# Altium project RT1166_DevSoM.PrjPcb
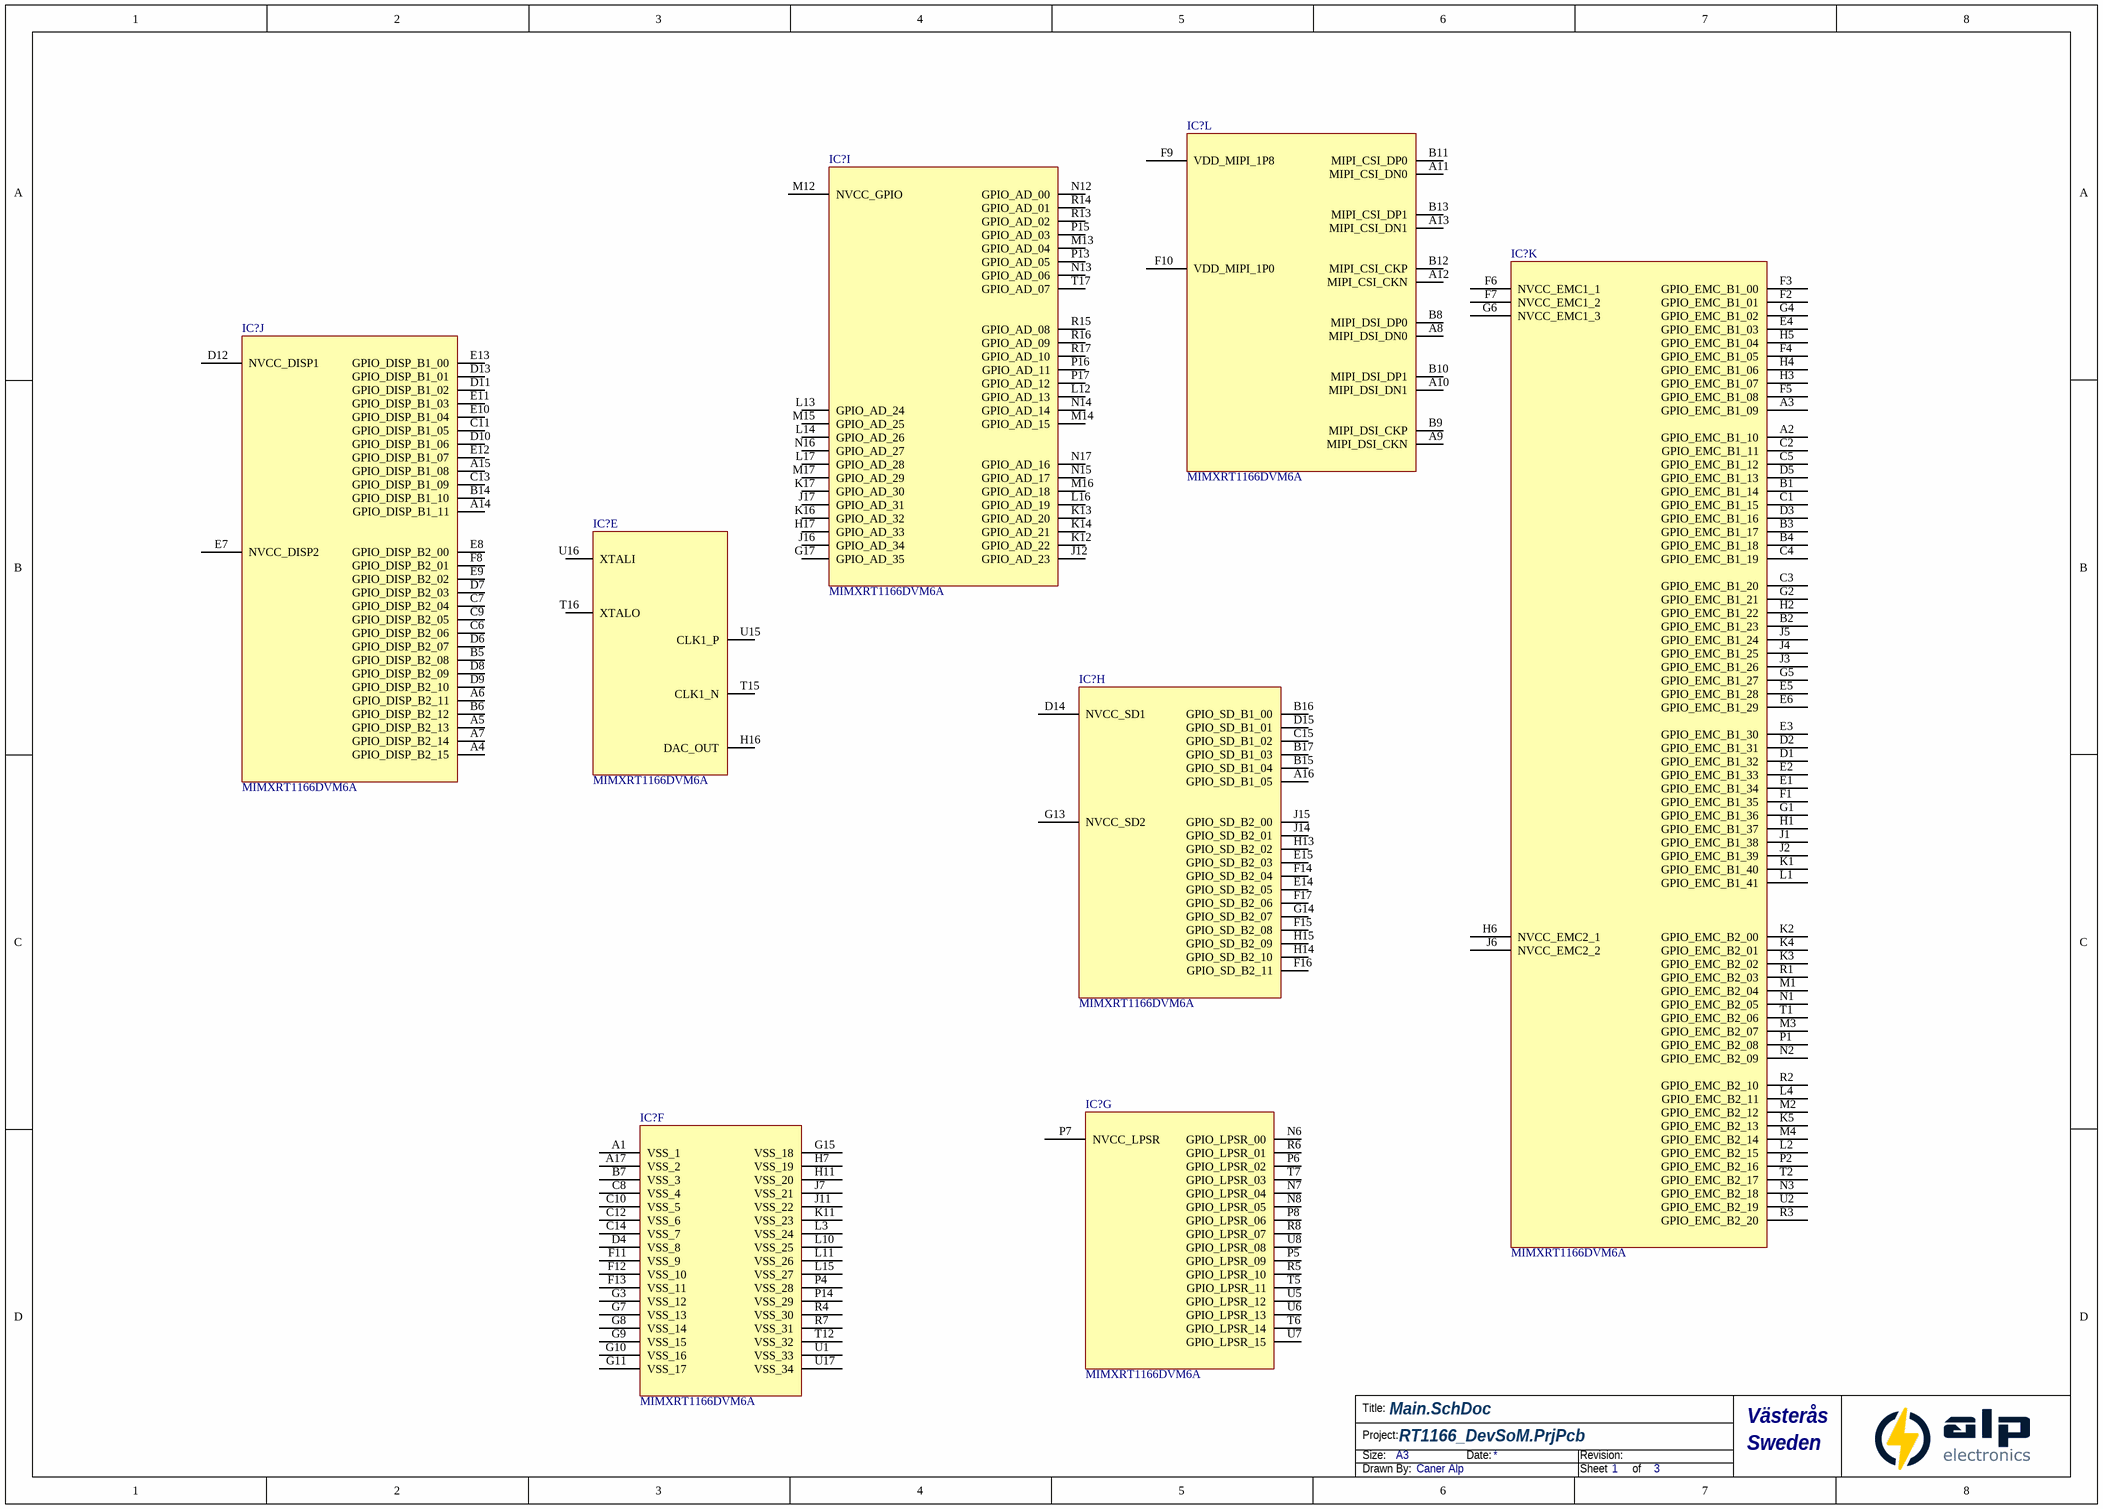
[diagram p0: Main.SchDoc]
3 sheets, 26 parts. Net scope: global (net labels, ports and power ports of the same name join across sheets).
Sheets:
  Main.SchDoc
  Power.SchDoc
  MCU Power.SchDoc

## Sheet Main.SchDoc
size A3; Author: ALP Electronics; CompanyName: ALP Electronics; DrawnBy: Caner Alp; Engineer: Caner Alp; Organization: ALP Electronics; Address2: Västerås; Address4: Sweden; SheetNumber: 1; SheetTotal: 3

### Parts
(Parts that share a designator on the sheet are numbered #1, #2 ... from top to bottom, then left to right.)
IC?#1  MIMXRT1166DVM6A  [BGA289C80P17X17_1400X1400X152]  (part L of 12)
IC?#2  MIMXRT1166DVM6A  [BGA289C80P17X17_1400X1400X152]  (part I of 12)
IC?#3  MIMXRT1166DVM6A  [BGA289C80P17X17_1400X1400X152]  (part K of 12)
IC?#4  MIMXRT1166DVM6A  [BGA289C80P17X17_1400X1400X152]  (part J of 12)
IC?#5  MIMXRT1166DVM6A  [BGA289C80P17X17_1400X1400X152]  (part E of 12)
IC?#6  MIMXRT1166DVM6A  [BGA289C80P17X17_1400X1400X152]  (part H of 12)
IC?#7  MIMXRT1166DVM6A  [BGA289C80P17X17_1400X1400X152]  (part G of 12)
IC?#8  MIMXRT1166DVM6A  [BGA289C80P17X17_1400X1400X152]  (part F of 12)

### Nets

Not connected (* = marked no-connect by the designer): IC?#1 A8(MIPI_DSI_DN0) A9(MIPI_DSI_CKN) A10(MIPI_DSI_DN1) A11(MIPI_CSI_DN0) A12(MIPI_CSI_CKN) A13(MIPI_CSI_DN1) B8(MIPI_DSI_DP0) B9(MIPI_DSI_CKP) B10(MIPI_DSI_DP1) B11(MIPI_CSI_DP0) B12(MIPI_CSI_CKP) B13(MIPI_CSI_DP1) F9(VDD_MIPI_1P8) F10(VDD_MIPI_1P0); IC?#2 G17(GPIO_AD_35) H17(GPIO_AD_33) J12(GPIO_AD_23) J16(GPIO_AD_34) J17(GPIO_AD_31) K12(GPIO_AD_22) K13(GPIO_AD_20) K14(GPIO_AD_21) K16(GPIO_AD_32) K17(GPIO_AD_30) L12(GPIO_AD_13) L13(GPIO_AD_24) L14(GPIO_AD_26) L16(GPIO_AD_19) L17(GPIO_AD_28) M12(NVCC_GPIO) M13(GPIO_AD_04) M14(GPIO_AD_15) M15(GPIO_AD_25) M16(GPIO_AD_18) M17(GPIO_AD_29) N12(GPIO_AD_00) N13(GPIO_AD_06) N14(GPIO_AD_14) N15(GPIO_AD_17) N16(GPIO_AD_27) N17(GPIO_AD_16) P13(GPIO_AD_05) P15(GPIO_AD_03) P16(GPIO_AD_11) P17(GPIO_AD_12) R13(GPIO_AD_02) R14(GPIO_AD_01) R15(GPIO_AD_08) R16(GPIO_AD_09) R17(GPIO_AD_10) T17(GPIO_AD_07); IC?#3 A2(GPIO_EMC_B1_10) A3(GPIO_EMC_B1_09) B1(GPIO_EMC_B1_14) B2(GPIO_EMC_B1_23) B3(GPIO_EMC_B1_17) B4(GPIO_EMC_B1_18) C1(GPIO_EMC_B1_15) C2(GPIO_EMC_B1_11) C3(GPIO_EMC_B1_20) C4(GPIO_EMC_B1_19) C5(GPIO_EMC_B1_12) D1(GPIO_EMC_B1_32) D2(GPIO_EMC_B1_31) D3(GPIO_EMC_B1_16) D5(GPIO_EMC_B1_13) E1(GPIO_EMC_B1_34) E2(GPIO_EMC_B1_33) E3(GPIO_EMC_B1_30) E4(GPIO_EMC_B1_03) E5(GPIO_EMC_B1_28) E6(GPIO_EMC_B1_29) F1(GPIO_EMC_B1_35) F2(GPIO_EMC_B1_01) F3(GPIO_EMC_B1_00) F4(GPIO_EMC_B1_05) F5(GPIO_EMC_B1_08) F6(NVCC_EMC1_1) F7(NVCC_EMC1_2) G1(GPIO_EMC_B1_36) G2(GPIO_EMC_B1_21) G4(GPIO_EMC_B1_02) G5(GPIO_EMC_B1_27) G6(NVCC_EMC1_3) H1(GPIO_EMC_B1_37) H2(GPIO_EMC_B1_22) H3(GPIO_EMC_B1_07) H4(GPIO_EMC_B1_06) H5(GPIO_EMC_B1_04) H6(NVCC_EMC2_1) J1(GPIO_EMC_B1_38) J2(GPIO_EMC_B1_39) J3(GPIO_EMC_B1_26) J4(GPIO_EMC_B1_25) J5(GPIO_EMC_B1_24) J6(NVCC_EMC2_2) K1(GPIO_EMC_B1_40) K2(GPIO_EMC_B2_00) K3(GPIO_EMC_B2_02) K4(GPIO_EMC_B2_01) K5(GPIO_EMC_B2_13) L1(GPIO_EMC_B1_41) L2(GPIO_EMC_B2_15) L4(GPIO_EMC_B2_11) M1(GPIO_EMC_B2_04) M2(GPIO_EMC_B2_12) M3(GPIO_EMC_B2_07) M4(GPIO_EMC_B2_14) N1(GPIO_EMC_B2_05) N2(GPIO_EMC_B2_09) N3(GPIO_EMC_B2_18) P1(GPIO_EMC_B2_08) P2(GPIO_EMC_B2_16) R1(GPIO_EMC_B2_03) R2(GPIO_EMC_B2_10) R3(GPIO_EMC_B2_20) T1(GPIO_EMC_B2_06) T2(GPIO_EMC_B2_17) U2(GPIO_EMC_B2_19); IC?#4 A4(GPIO_DISP_B2_15) A5(GPIO_DISP_B2_13) A6(GPIO_DISP_B2_11) A7(GPIO_DISP_B2_14) A14(GPIO_DISP_B1_11) A15(GPIO_DISP_B1_08) B5(GPIO_DISP_B2_08) B6(GPIO_DISP_B2_12) B14(GPIO_DISP_B1_10) C6(GPIO_DISP_B2_06) C7(GPIO_DISP_B2_04) C9(GPIO_DISP_B2_05) C11(GPIO_DISP_B1_05) C13(GPIO_DISP_B1_09) D6(GPIO_DISP_B2_07) D7(GPIO_DISP_B2_03) D8(GPIO_DISP_B2_09) D9(GPIO_DISP_B2_10) D10(GPIO_DISP_B1_06) D11(GPIO_DISP_B1_02) D12(NVCC_DISP1) D13(GPIO_DISP_B1_01) E7(NVCC_DISP2) E8(GPIO_DISP_B2_00) E9(GPIO_DISP_B2_02) E10(GPIO_DISP_B1_04) E11(GPIO_DISP_B1_03) E12(GPIO_DISP_B1_07) E13(GPIO_DISP_B1_00) F8(GPIO_DISP_B2_01); IC?#5 H16(DAC_OUT) T15(CLK1_N) T16(XTALO) U15(CLK1_P) U16(XTALI); IC?#6 A16(GPIO_SD_B1_05) B15(GPIO_SD_B1_04) B16(GPIO_SD_B1_00) B17(GPIO_SD_B1_03) C15(GPIO_SD_B1_02) D14(NVCC_SD1) D15(GPIO_SD_B1_01) E14(GPIO_SD_B2_05) E15(GPIO_SD_B2_03) F14(GPIO_SD_B2_04) F15(GPIO_SD_B2_08) F16(GPIO_SD_B2_11) F17(GPIO_SD_B2_06) G13(NVCC_SD2) G14(GPIO_SD_B2_07) H13(GPIO_SD_B2_02) H14(GPIO_SD_B2_10) H15(GPIO_SD_B2_09) J14(GPIO_SD_B2_01) J15(GPIO_SD_B2_00); IC?#7 N6(GPIO_LPSR_00) N7(GPIO_LPSR_04) N8(GPIO_LPSR_05) P5(GPIO_LPSR_09) P6(GPIO_LPSR_02) P7(NVCC_LPSR) P8(GPIO_LPSR_06) R5(GPIO_LPSR_10) R6(GPIO_LPSR_01) R8(GPIO_LPSR_07) T5(GPIO_LPSR_11) T6(GPIO_LPSR_14) T7(GPIO_LPSR_03) U5(GPIO_LPSR_12) U6(GPIO_LPSR_13) U7(GPIO_LPSR_15) U8(GPIO_LPSR_08); IC?#8 A1(VSS_1) A17(VSS_2) B7(VSS_3) C8(VSS_4) C10(VSS_5) C12(VSS_6) C14(VSS_7) D4(VSS_8) F11(VSS_9) F12(VSS_10) F13(VSS_11) G3(VSS_12) G7(VSS_13) G8(VSS_14) G9(VSS_15) G10(VSS_16) G11(VSS_17) G15(VSS_18) H7(VSS_19) H11(VSS_20) J7(VSS_21) J11(VSS_22) K11(VSS_23) L3(VSS_24) L10(VSS_25) L11(VSS_26) L15(VSS_27) P4(VSS_28) P14(VSS_29) R4(VSS_30) R7(VSS_31) T12(VSS_32) U1(VSS_33) U17(VSS_34)

### Notes on the sheet
- Title:
- Size:
- Project:
- A3
- Date:
- Revision:
- Drawn By:
- Sheet
- of

### Library data of the parts
IC?#1-IC?#8 = MIMXRT1166DVM6A: Integrated Circuit; Manufacturer_Name: NXP; Datasheet Link: https://www.mouser.in/datasheet/2/302/IMXRT1160CEC-2335852.pdf; Height: 1.52mm; Manufacturer_Part_Number: MIMXRT1166DVM6A; Mouser Part Number: 771-MIMXRT1166DVM6A; Mouser Price/Stock: https://www.mouser.co.uk/ProductDetail/NXP-Semiconductors/MIMXRT1166DVM6A?qs=DRkmTr78QARbPfoaiaD1vg%3D%3D

## Sheet Power.SchDoc
size A3; Author: ALP Electronics; CompanyName: ALP Electronics; DrawnBy: Caner Alp; Engineer: Caner Alp; Organization: ALP Electronics; Address2: Västerås; Address4: Sweden; SheetNumber: 2; SheetTotal: 3
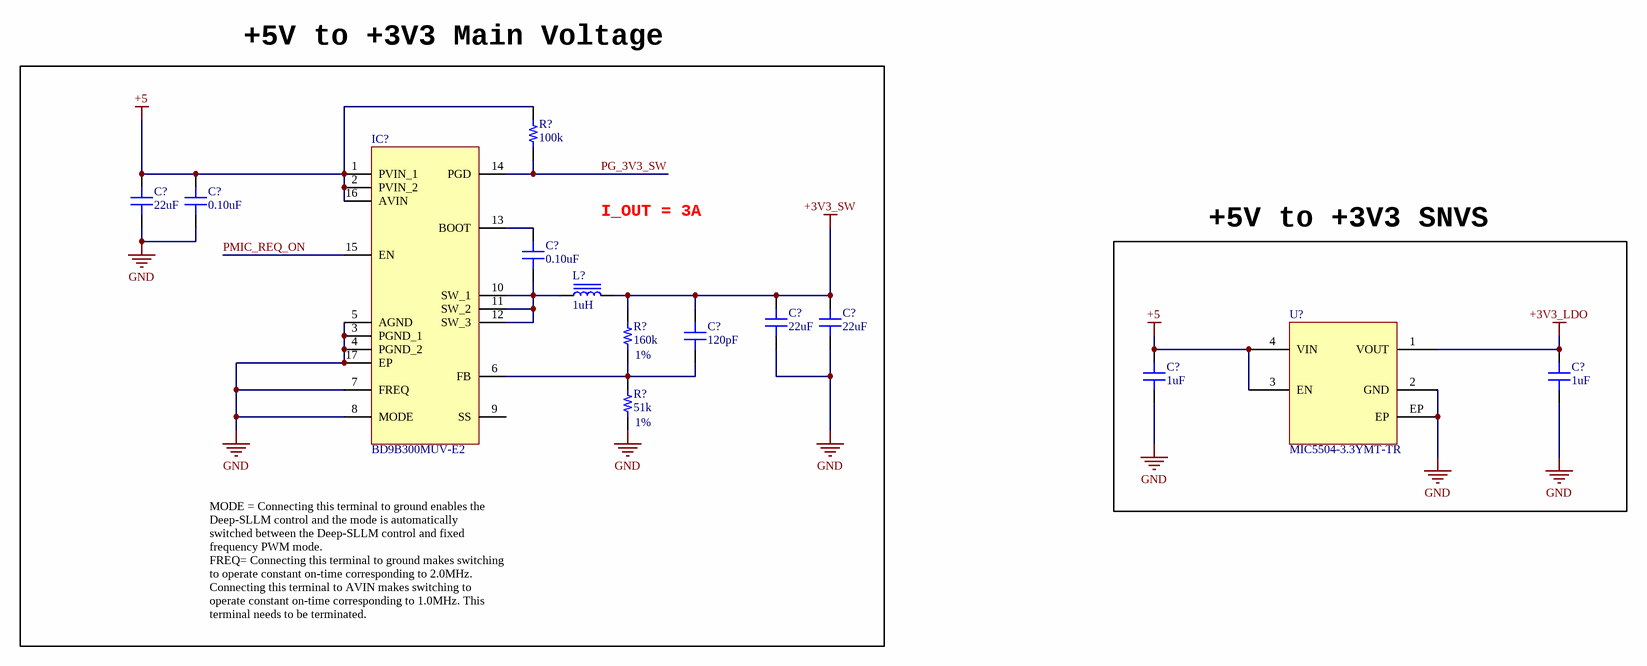
[diagram p1: Power.SchDoc]

### Parts
(Parts that share a designator on the sheet are numbered #1, #2 ... from top to bottom, then left to right.)
C?#1  22uF  [CAP 0805/2012]
C?#2  0.10uF  [CAP 0402/1005]
C?#3  0.10uF  [CAP 0402/1005]
C?#4  22uF  [CAP 0805/2012]
C?#5  22uF  [CAP 0805/2012]
C?#6  120pF  [CAP 0402/1005]
C?#7  1uF  [CAP 0402/1005]
C?#8  1uF  [CAP 0402/1005]
IC?#9  BD9B300MUV-E2  [QFN50P300X300X100-17N-D]
L?  1uH  [TDK VLS252012HBX-1]
R?#1  100k  [RES 0402/1005]
R?#2  160k  Tolerance: 1%  [RES 0402/1005]
R?#3  51k  Tolerance: 1%  [RES 0402/1005]
U?  MIC5504-3.3YMT-TR  [VREG_MIC5504-3.3YMT-TZ]

### Blocks framed on the sheet
+5V to +3V3 Main Voltage: C?#1-C?#6 IC?#9 L? R?#1-R?#3
+5V to +3V3 SNVS: C?#7 C?#8 U?

### Nets
+3V3_LDO: C?#8.2 U?.1(VOUT)
+3V3_SW: C?#4.2 C?#5.2 C?#6.2 L?.2 R?#2.2
+5: C?#1.2 C?#2.2 C?#7.2 IC?#9.1(PVIN_1) IC?#9.2(PVIN_2) IC?#9.16(AVIN) R?#1.1 U?.3(EN) U?.4(VIN)
GND: C?#1.1 C?#2.1 C?#4.1 C?#5.1 C?#7.1 C?#8.1 IC?#9.3(PGND_1) IC?#9.4(PGND_2) IC?#9.5(AGND) IC?#9.7(FREQ) IC?#9.8(MODE) IC?#9.17(EP) R?#3.1 U?.2(GND) U?.EP
PG_3V3_SW: IC?#9.14(PGD) R?#1.2
PMIC_REQ_ON: IC?#9.15(EN)
NetC?#3_1: C?#3.1 IC?#9.10(SW_1) IC?#9.11(SW_2) IC?#9.12(SW_3) L?.1
NetC?#3_2: C?#3.2 IC?#9.13(BOOT)
NetC?#6_1: C?#6.1 IC?#9.6(FB) R?#2.1 R?#3.2

Not connected (* = marked no-connect by the designer): IC?#9 9(SS)

### Notes on the sheet
- I_OUT = 3A
- MODE = Connecting this terminal to ground enables the Deep-SLLM control and the mode is automatically  switched between the Deep-SLLM control and fixed frequency PWM mode.
  FREQ= Connecting this terminal to ground makes switching to operate constant on-time corresponding to 2.0MHz. Connecting this terminal to AVIN makes switching to operate constant on-time corresponding to 1.0MHz. This terminal needs to be terminated.
- Title:
- Size:
- Project:
- A3
- Date:
- Revision:
- Drawn By:
- Sheet
- of

### Library data of the parts
C?#1 C?#4 C?#5 = C2012X5R0J226M125AC: CAP CER 22UF 6.3V X5R 0805; Manufacturer: TDK Corporation; TemperatureRange: -55C ~ 85C; Tolerance: 20%; Value: 22uF; Part Number: C2012X5R0J226M125AC; PartId: 4616; Supplier 1: Digi-Key; Supplier Part Number 1: 445-1422-2-ND; ComponentLink1Description: Datasheet; ComponentLink1URL: https://product.tdk.com/info/en/catalog/datasheets/mlcc_commercial_general_en.pdf; ComponentLink2Description: Digi-Key listing; ComponentLink2URL: http://digikey.com/product-detail/en/C2012X5R0J226M125AC/445-1422-2-ND/569048; TemperatureCoefficient: X5R; Voltage: 6.3V; Price: 0,0861; Type: -; Device Package: 0805 (2012 Metric)
C?#2 C?#3 = LMK105BJ104KV-F: CAP CER 0.1UF 10V X5R 0402; Manufacturer: Taiyo Yuden; TemperatureRange: -55C ~ 85C; Tolerance: 10%; Value: 0.10uF; Part Number: LMK105BJ104KV-F; PartId: 12322; Supplier 1: Digi-Key; Supplier Part Number 1: 587-1227-2-ND; ComponentLink1Description: Datasheet; ComponentLink1URL: http://ds.yuden.co.jp/TYCOMPAS/ut/detail.do?productNo=LMK105BJ104KV-F&fileName=LMK105BJ104KV-F_SS&mode=specSheetDownload; ComponentLink2Description: Digi-Key Listing; ComponentLink2URL: https://www.digikey.com/product-detail/en/taiyo-yuden/LMK105BJ104KV-F/587-1227-2-ND/930579; TemperatureCoefficient: X5R; Voltage: 10V; Price: 0,0021; Device Package: 0402 (1005 Metric)
C?#6 = C1005C0G1H121J050BA: CAP CER 120PF 50V C0G 0402; Manufacturer: TDK Corporation; TemperatureRange: -55C ~ 125C; TemperatureCoefficient: C0G, NP0; Tolerance: 5%; Value: 120pF; Part Number: C1005C0G1H121J050BA; PartId: 3919; Supplier 1: Digi-Key; Supplier Part Number 1: 445-1248-2-ND; ComponentLink1Description: Datasheet; ComponentLink1URL: https://product.tdk.com/info/en/catalog/datasheets/mlcc_commercial_general_en.pdf; ComponentLink2Description: Digi-Key listing; ComponentLink2URL: http://digikey.com/product-detail/en/C1005C0G1H121J050BA/445-1248-2-ND/513669; Voltage: 50V; Price: 0,0075; Type: -; Device Package: 0402 (1005 Metric)
C?#7 C?#8 = GRM155R70J105KA12D: CAP CER 1UF 6.3V X7R 0402; Manufacturer: Murata Electronics North America; TemperatureRange: -55C ~ 125C; Tolerance: 10%; Type: Derating Recommended; Value: 1uF; Part Number: GRM155R70J105KA12D; PartId: 5157; Supplier 1: Digi-Key; Supplier Part Number 1: 490-10024-2-ND; ComponentLink1Description: Datasheet; ComponentLink1URL: http://www.murata.com/~/media/webrenewal/support/library/catalog/products/capacitor/mlcc/c02e.ashx; ComponentLink2Description: Digi-Key listing; ComponentLink2URL: http://digikey.com/product-detail/en/GRM155R70J105KA12D/490-10024-2-ND/5027109; TemperatureCoefficient: X7R; Voltage: 6.3V; Price: 0,019; Device Package: 0402 (1005 Metric)
IC?#9 = BD9B300MUV-E2: Integrated Circuit; Manufacturer_Name: ROHM Semiconductor; Datasheet Link: http://rohmfs.rohm.com/en/products/databook/datasheet/ic/power/switching_regulator/bd9b300muv-e.pdf; Height: 1mm; Manufacturer_Part_Number: BD9B300MUV-E2; Mouser Part Number: 755-BD9B300MUV-E2; Mouser Price/Stock: https://www.mouser.com/Search/Refine.aspx?Keyword=755-BD9B300MUV-E2
L? = VLS252012HBX-1R0M-1: FIXED IND 1UH 3.4A 56 MOHM SMD; Manufacturer: TDK Corporation; Type: Wirewound; Tolerance: 20%; Shielding: Shielded; DC Resistance (DCR): 56 mOhm Max; Value: 1uH; Part Number: VLS252012HBX-1R0M-1; PartId: 9554; Supplier 1: Digi-Key; Supplier Part Number 1: 445-173025-2-ND; ComponentLink1Description: Datasheet; ComponentLink1URL: https://product.tdk.com/info/en/catalog/datasheets/inductor_commercial_power_vls252012hbx-1_en.pdf; ComponentLink2Description: Digi-Key Listing; ComponentLink2URL: https://www.digikey.com/product-detail/en/VLS252012HBX-1R0M-1/445-173025-2-ND/5147063; Price: 0,2815; Device Package: 1008 (2520 Metric); Series: VLS-HBX-1; Inductance: 1uH; Current Rating: 3.4A; Q @ Freq: -; Frequency - Self Resonant: -; Operating Temperature: -40C ~ 105C
R?#1 = ERJ-2GEJ104X: RES SMD 100K OHM 5% 1/10W 0402; Manufacturer: Panasonic Electronic Components; TemperatureRange: -55C ~ 155C; TemperatureCoefficient: 200ppm/C; PowerRating: 0.1W, 1/10W; Value: 100k; Part Number: ERJ-2GEJ104X; PartId: 10985; Supplier 1: Digi-Key; Supplier Part Number 1: P100KJTR-ND; ComponentLink1Description: Datasheet; ComponentLink1URL: http://industrial.panasonic.com/www-cgi/jvcr13pz.cgi?E+PZ+3+AOA0001+ERJ2GEJ104X+7+WW; ComponentLink2Description: Digi-Key Listing; ComponentLink2URL: https://www.digikey.com/product-detail/en/panasonic-electronic-components/ERJ-2GEJ104X/P100KJTR-ND/146731; Tolerance: 5%; Price: 0,0019; Device Package: 0402 (1005 Metric)
R?#2 = ERJ-2RKF1603X: RES SMD 160K OHM 1% 1/10W 0402; Manufacturer: Panasonic Electronic Components; TemperatureRange: -55C ~ 155C; TemperatureCoefficient: 100ppm/C; PowerRating: 0.1W, 1/10W; Value: 160k; Part Number: ERJ-2RKF1603X; PartId: 444; Supplier 1: Digi-Key; Supplier Part Number 1: P160KLTR-ND; ComponentLink1Description: Datasheet; ComponentLink1URL: http://industrial.panasonic.com/www-cgi/jvcr13pz.cgi?E+PZ+3+AOA0002+ERJ2RKF1603X+7+WW; ComponentLink2Description: Digikey listing; ComponentLink2URL: http://digikey.com/product-detail/en/ERJ-2RKF1603X/P160KLTR-ND/1746134; Price: 0,0043; Type: Thick Film; Device Package: 0402 (1005 Metric)
R?#3 = ERJ-2RKF5102X: RES SMD 51K OHM 1% 1/10W 0402; Manufacturer: Panasonic Electronic Components; TemperatureRange: -55C ~ 155C; TemperatureCoefficient: 100ppm/C; PowerRating: 0.1W, 1/10W; Value: 51k; Part Number: ERJ-2RKF5102X; PartId: 166; Supplier 1: Digi-Key; Supplier Part Number 1: P51.0KLTR-ND; ComponentLink1Description: Datasheet; ComponentLink1URL: http://industrial.panasonic.com/www-cgi/jvcr13pz.cgi?E+PZ+3+AOA0002+ERJ2RKF5102X+7+WW; ComponentLink2Description: Digikey listing; ComponentLink2URL: http://digikey.com/product-detail/en/ERJ-2RKF5102X/P51.0KLTR-ND/1647131; Price: 0,0043; Type: Thick Film; Device Package: 0402 (1005 Metric)
U? = MIC5504-3.3YMT-TR: 300mA LDO

## Sheet MCU Power.SchDoc
size A3; Author: ALP Electronics; CompanyName: ALP Electronics; DrawnBy: Caner Alp; Engineer: Caner Alp; Organization: ALP Electronics; Address2: Västerås; Address4: Sweden; SheetNumber: 3; SheetTotal: 3
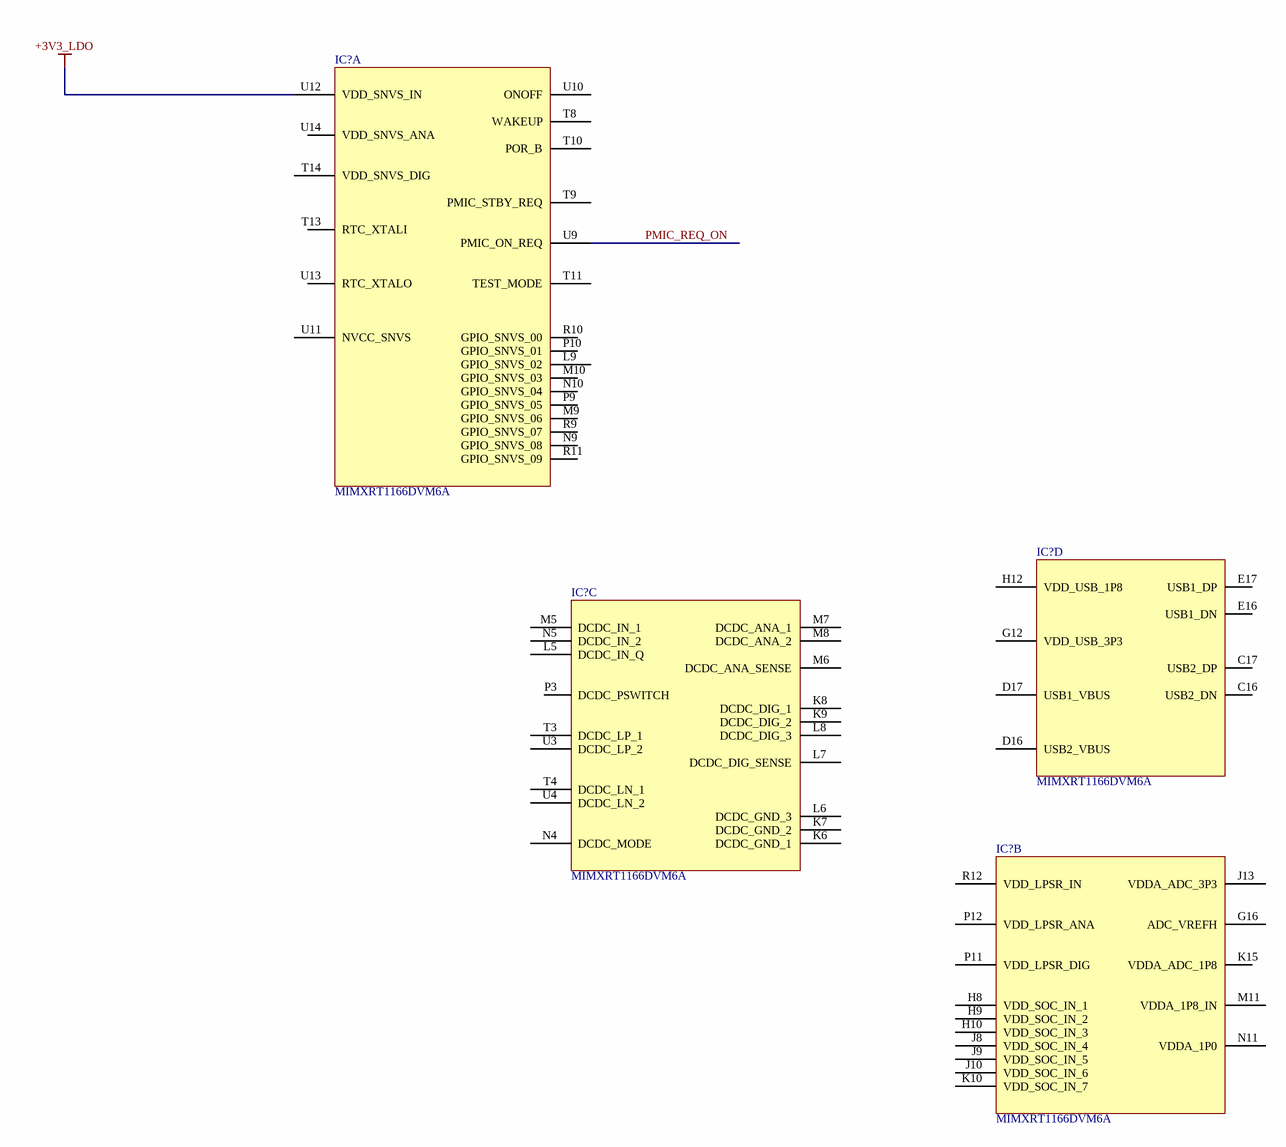
[diagram p2: MCU Power.SchDoc]

### Parts
(Parts that share a designator on the sheet are numbered #1, #2 ... from top to bottom, then left to right.)
IC?#10  MIMXRT1166DVM6A  [BGA289C80P17X17_1400X1400X152]  (part A of 12)
IC?#11  MIMXRT1166DVM6A  [BGA289C80P17X17_1400X1400X152]  (part D of 12)
IC?#12  MIMXRT1166DVM6A  [BGA289C80P17X17_1400X1400X152]  (part C of 12)
IC?#13  MIMXRT1166DVM6A  [BGA289C80P17X17_1400X1400X152]  (part B of 12)

### Nets
+3V3_LDO: IC?#10.U12(VDD_SNVS_IN)
PMIC_REQ_ON: IC?#10.U9(PMIC_ON_REQ)

Not connected (* = marked no-connect by the designer): IC?#10 L9(GPIO_SNVS_02) M9(GPIO_SNVS_06) M10(GPIO_SNVS_03) N9(GPIO_SNVS_08) N10(GPIO_SNVS_04) P9(GPIO_SNVS_05) P10(GPIO_SNVS_01) R9(GPIO_SNVS_07) R10(GPIO_SNVS_00) R11(GPIO_SNVS_09) T8(WAKEUP) T9(PMIC_STBY_REQ) T10(POR_B) T11(TEST_MODE) T13(RTC_XTALI) T14(VDD_SNVS_DIG) U10(ONOFF) U11(NVCC_SNVS) U13(RTC_XTALO) U14(VDD_SNVS_ANA); IC?#11 C16(USB2_DN) C17(USB2_DP) D16(USB2_VBUS) D17(USB1_VBUS) E16(USB1_DN) E17(USB1_DP) G12(VDD_USB_3P3) H12(VDD_USB_1P8); IC?#12 K6(DCDC_GND_1) K7(DCDC_GND_2) K8(DCDC_DIG_1) K9(DCDC_DIG_2) L5(DCDC_IN_Q) L6(DCDC_GND_3) L7(DCDC_DIG_SENSE) L8(DCDC_DIG_3) M5(DCDC_IN_1) M6(DCDC_ANA_SENSE) M7(DCDC_ANA_1) M8(DCDC_ANA_2) N4(DCDC_MODE) N5(DCDC_IN_2) P3(DCDC_PSWITCH) T3(DCDC_LP_1) T4(DCDC_LN_1) U3(DCDC_LP_2) U4(DCDC_LN_2); IC?#13 G16(ADC_VREFH) H8(VDD_SOC_IN_1) H9(VDD_SOC_IN_2) H10(VDD_SOC_IN_3) J8(VDD_SOC_IN_4) J9(VDD_SOC_IN_5) J10(VDD_SOC_IN_6) J13(VDDA_ADC_3P3) K10(VDD_SOC_IN_7) K15(VDDA_ADC_1P8) M11(VDDA_1P8_IN) N11(VDDA_1P0) P11(VDD_LPSR_DIG) P12(VDD_LPSR_ANA) R12(VDD_LPSR_IN)

### Notes on the sheet
- Title:
- Size:
- Project:
- A3
- Date:
- Revision:
- Drawn By:
- Sheet
- of

### Library data of the parts
IC?#10-IC?#13 = MIMXRT1166DVM6A: as IC?#1 on sheet Main; Datasheet Link: https://www.mouser.in/datasheet/2/302/IMXRT1160CEC-2335852.pdf; Height: 1.52mm; Manufacturer_Part_Number: MIMXRT1166DVM6A; Mouser Part Number: 771-MIMXRT1166DVM6A; Mouser Price/Stock: https://www.mouser.co.uk/ProductDetail/NXP-Semiconductors/MIMXRT1166DVM6A?qs=DRkmTr78QARbPfoaiaD1vg%3D%3D

## Nets that join several sheets
+3V3_LDO: Power (C?#8.2 U?.1), MCU Power (IC?#10.U12)
PMIC_REQ_ON: Power (IC?#9.15), MCU Power (IC?#10.U9)